# EAGLE design sonda7 (EAGLE 4.16)
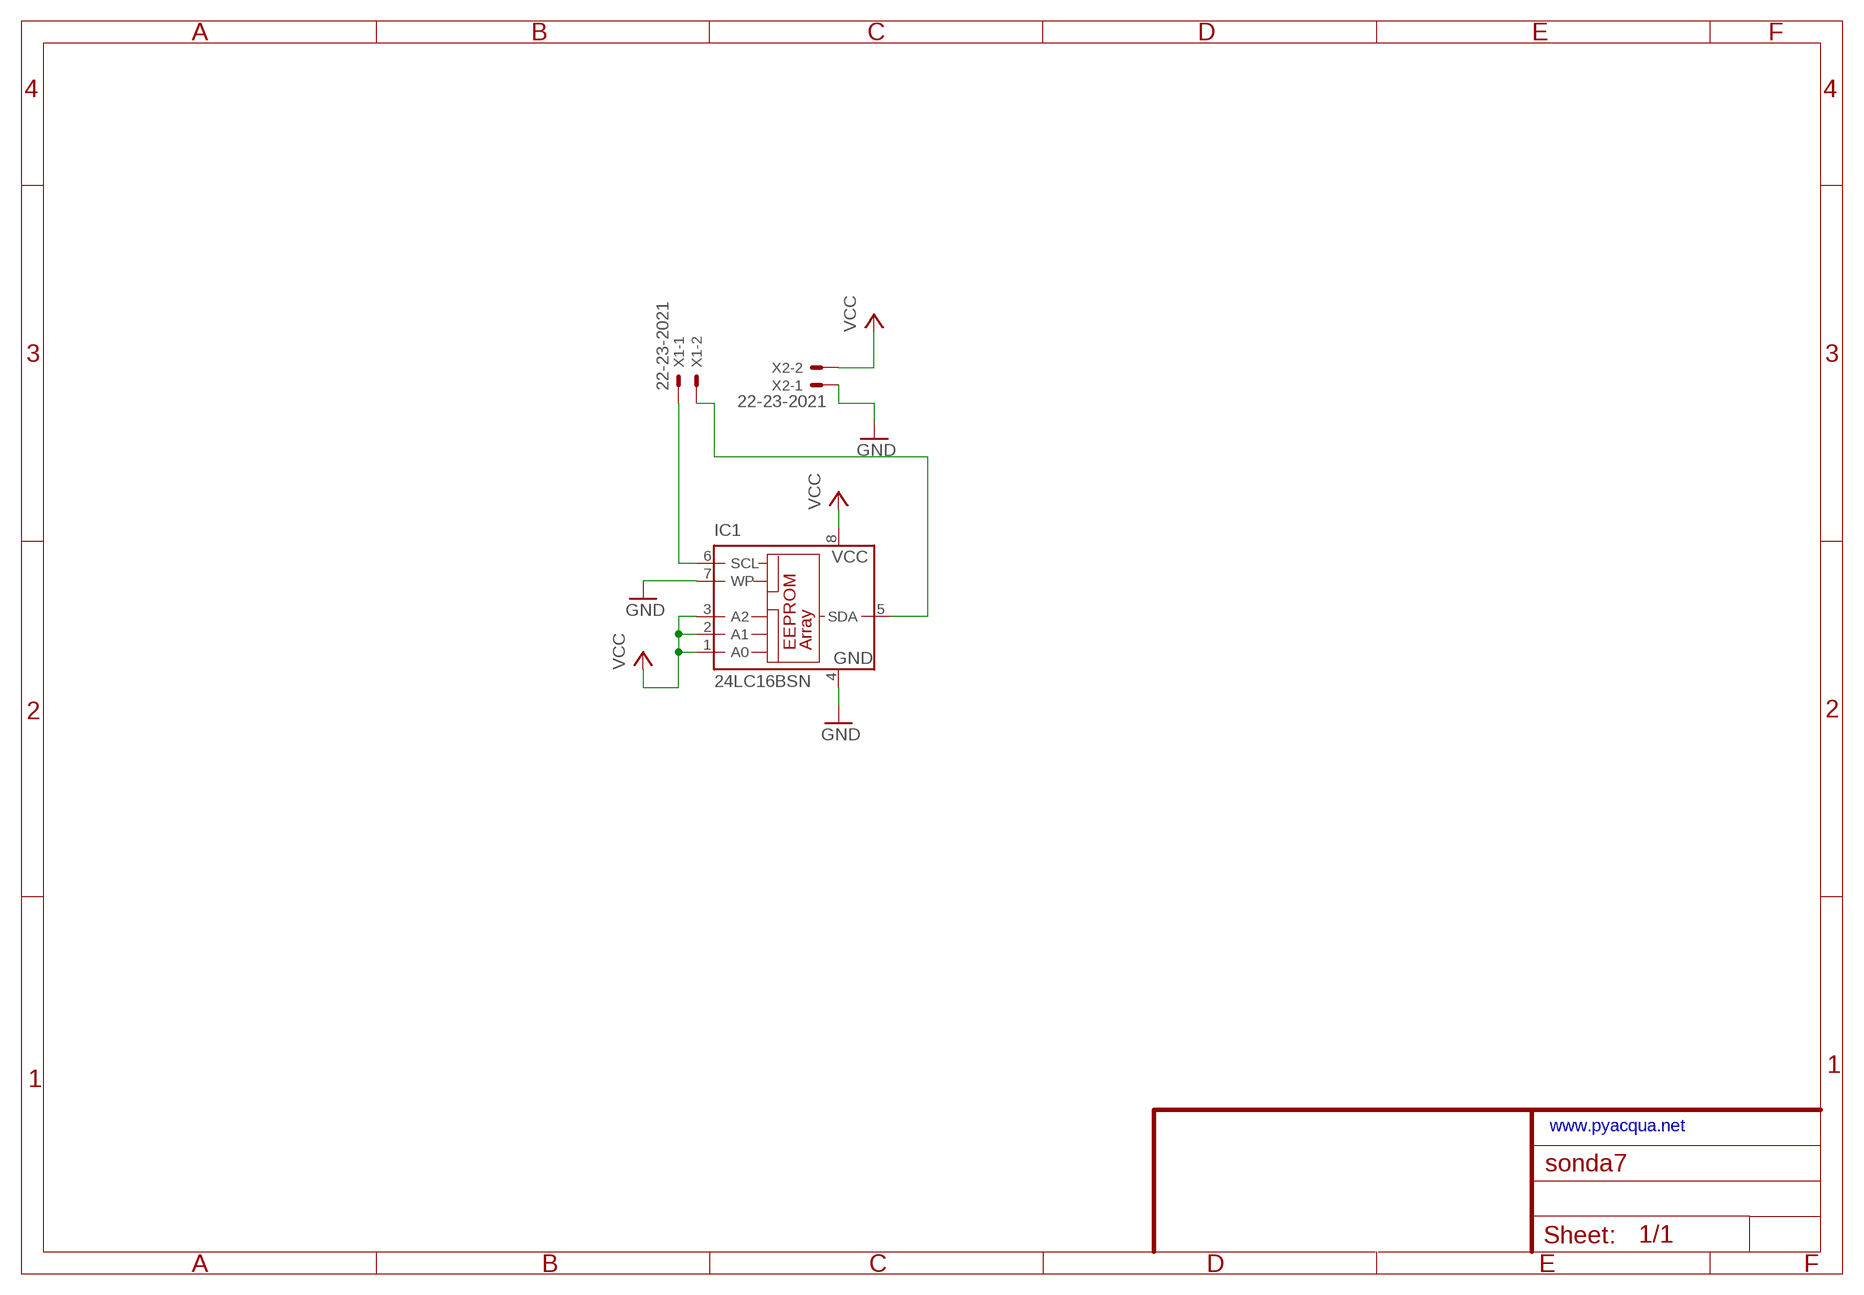
[diagram p0: schematic, sheet 1]

## Parts
IC1  24LC16BSN  [SO-08]
X1  22-23-2021  [22-23-2021]
X2  22-23-2021  [22-23-2021]

## Nets
GND: IC1.4(GND) IC1.7(WP) X2.1
N$1: IC1.6(SCL) X1.1
N$2: IC1.5(SDA) X1.2
VCC: IC1.1(A0) IC1.2(A1) IC1.3(A2) IC1.8(VCC) X2.2

## Notes on the sheet
- www.pyacqua.net

## Library data of the parts
IC1 = microchip:24*: Serial EEPROM I2C
X1 X2 = con-molex:22-23-2021: .100" (2.54mm) Center Header - 2 Pin

## Board
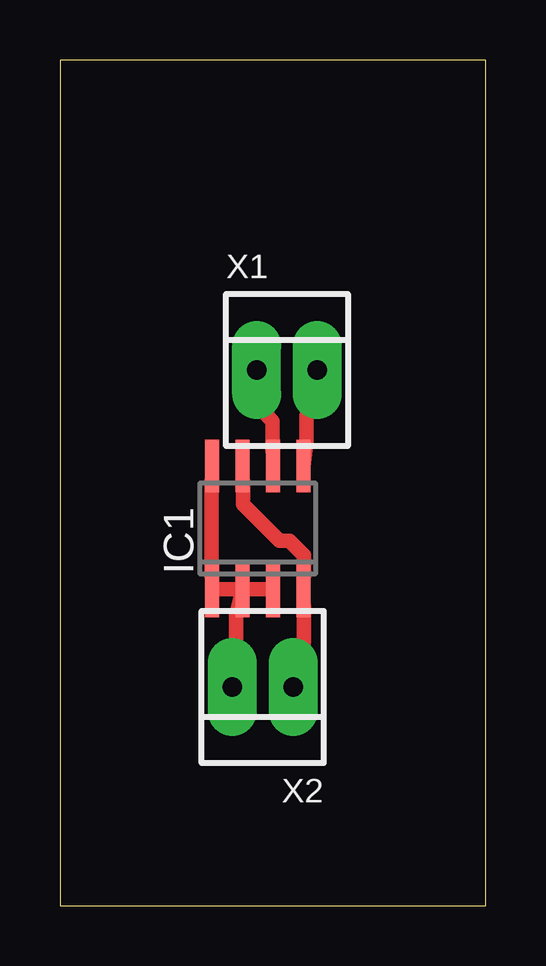
[diagram p1: board, top side]

Size 17.76 x 35.23 mm. Coordinates in mm from the lower left corner, seen from the top.
Outline: 0,0 17.76,0 17.76,35.23 0,35.23 0,0
Copper layers (1*16): Top 0.035mm / dielectric 1.5mm / Bottom 0.035mm
Design rules "mio2": minimum track width 24mil, minimum drill 24mil, track to track 24mil, track to pad 24mil, pad to pad 24mil, via to via 24mil, smd to smd 24mil, copper to edge 40mil, drill to drill 8mil, minimum pad ring 24mil, minimum via ring 24mil, stop-mask expansion 4mil, vias tented up to drill 0mil, thermal gap 10mil

### Footprints (pad centres in the part's own frame; a part is rotated, then mirrored left to right if it is on the bottom)
SO-08 = smd 0.6 x 2.2: 1 -1.905,-2.6; 2 -0.635,-2.6; 3 0.635,-2.6; 4 1.905,-2.6; 5 1.905,2.6; 6 0.635,2.6; 7 -0.635,2.6; 8 -1.905,2.6
22-23-2021 = drill 0.813 long: 1 -1.27,0; 2 1.27,0

### Placement (x,y rotation side)
IC1  8.25,15.71 0 top
U$1  [A4P-LOC]  -69.22,-115.1 0 top  (outside the outline)
X1  9.47,22.31 0 top
X2  8.45,9.11 180 top

### Tracks (layer width: path | path; a pad name or v marks a point on that pad's centre or on a via)
GND
  Top 0.61: IC1.7 7.64,17.23 7.64,16.73 9.16,15.2 9.57,15.2 10.18,14.59 10.18,14.19 IC1.4 10.18,12.05 10.18,11.04 X2.1
N$1
  Top 0.61: IC1.6 8.86,19.37 8.86,20.18 8.66,20.38 X1.1
N$2
  Top 0.61: IC1.5 10.28,19.37 10.28,20.38 X1.2
VCC
  Top 0.61: IC1.2 7.34,13.17 6.62,13.17 IC1.1 6.32,14.19 6.32,17.23 IC1.8 | IC1.3 8.66,13.17 7.84,13.17 IC1.2 | X2.2 7.34,11.04 7.34,12.05 IC1.2

### Text on the board
Pads: www.pyacqua.net